# EAGLE design 16-Channel PWM Driver(PCA9685) (EAGLE 6.4)
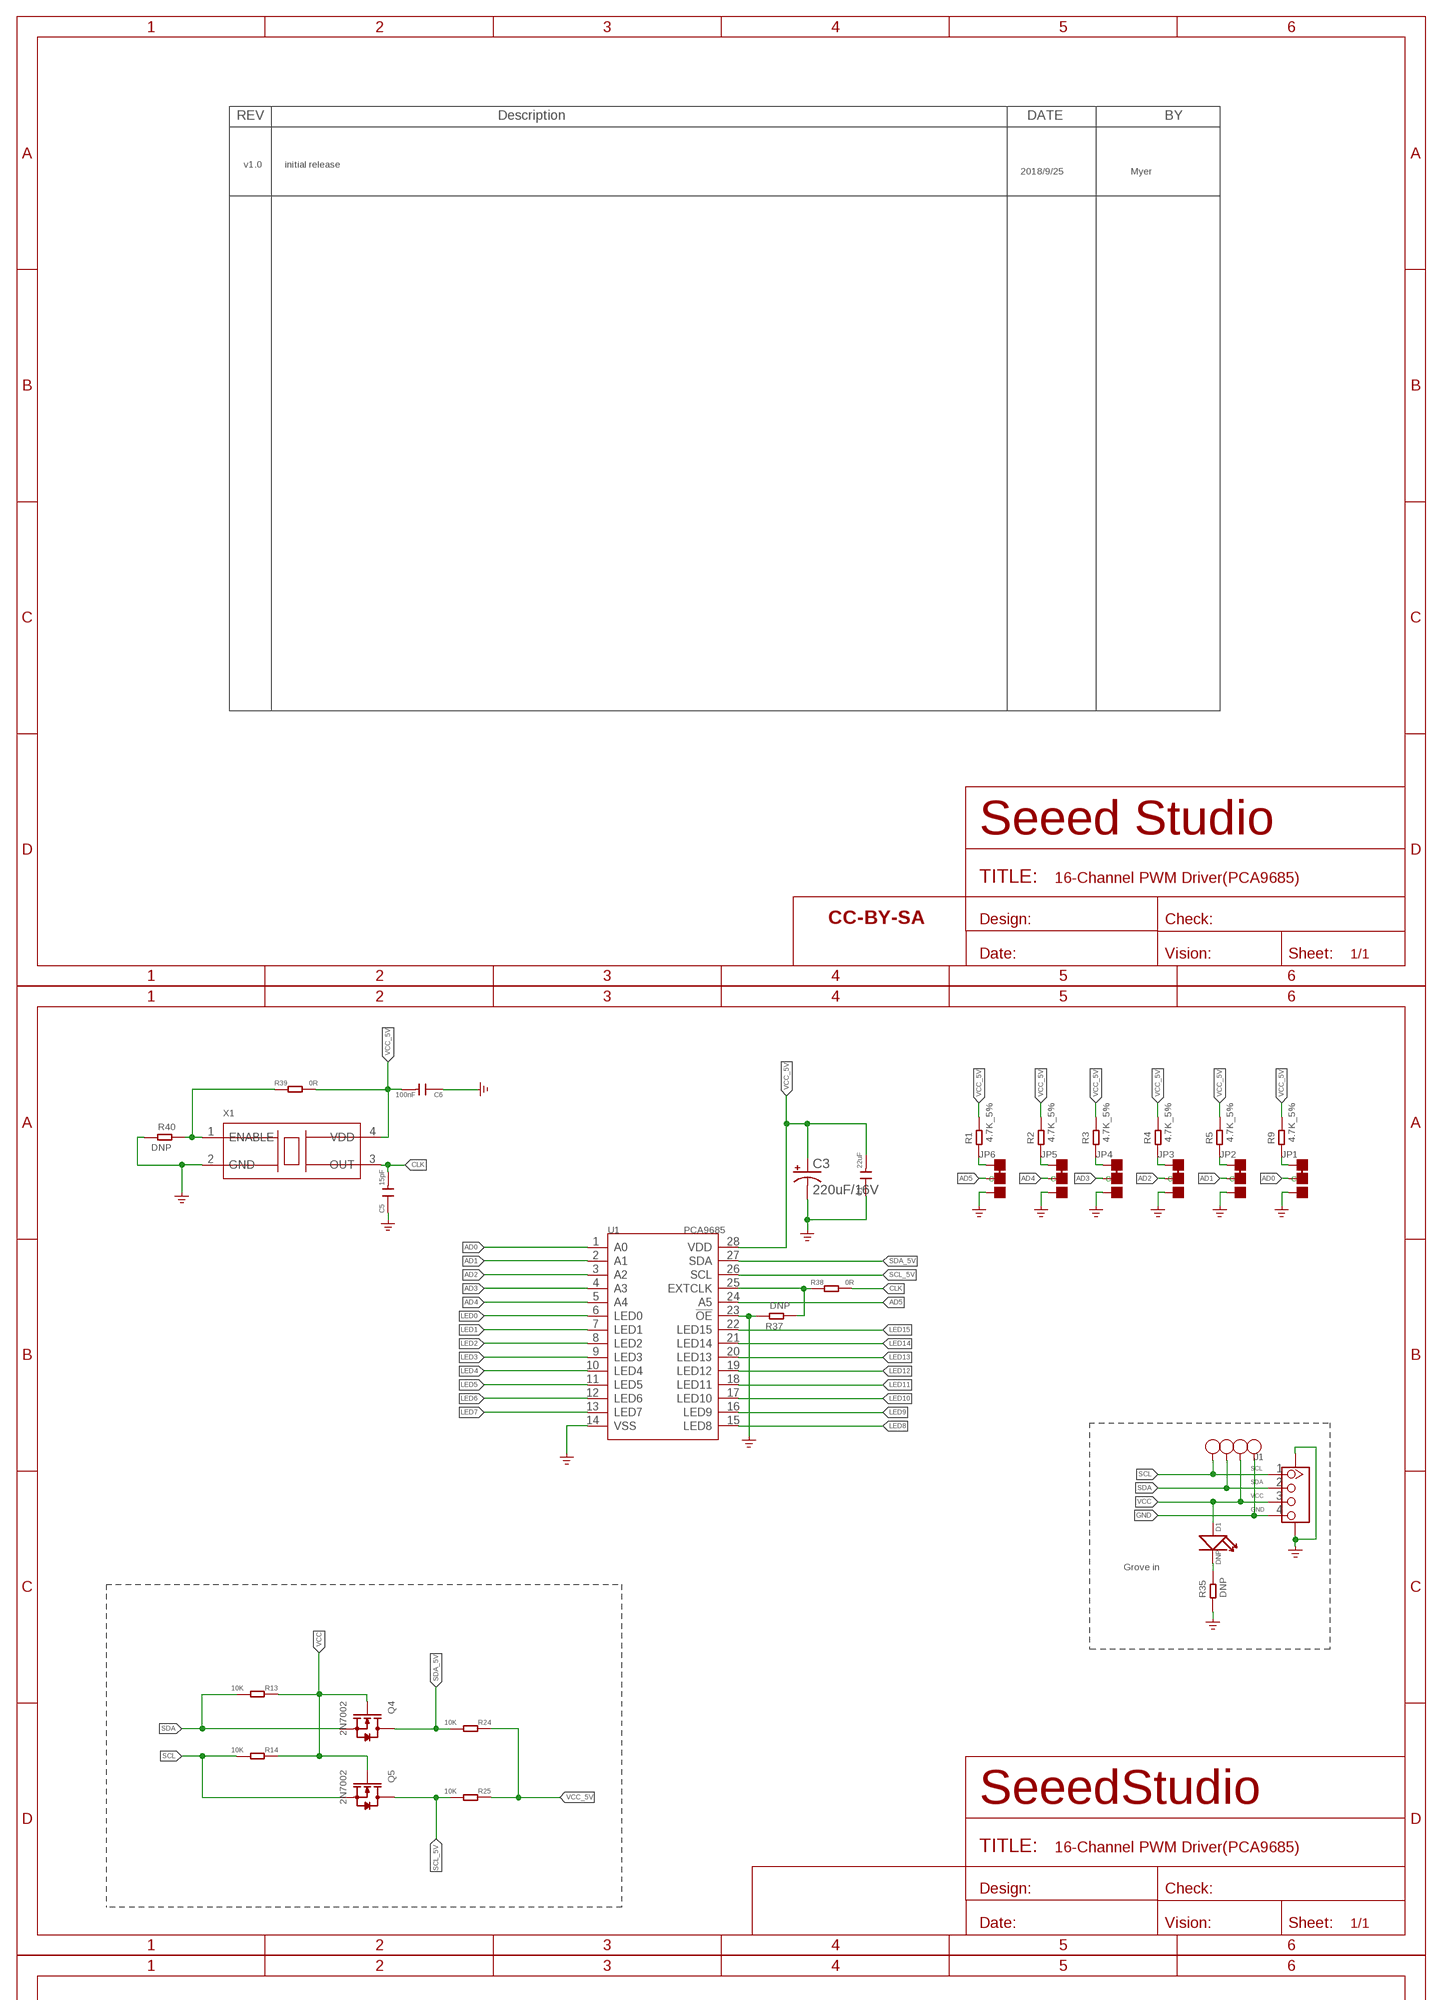
[diagram p0: schematic, sheet 1, part 1 of 2]
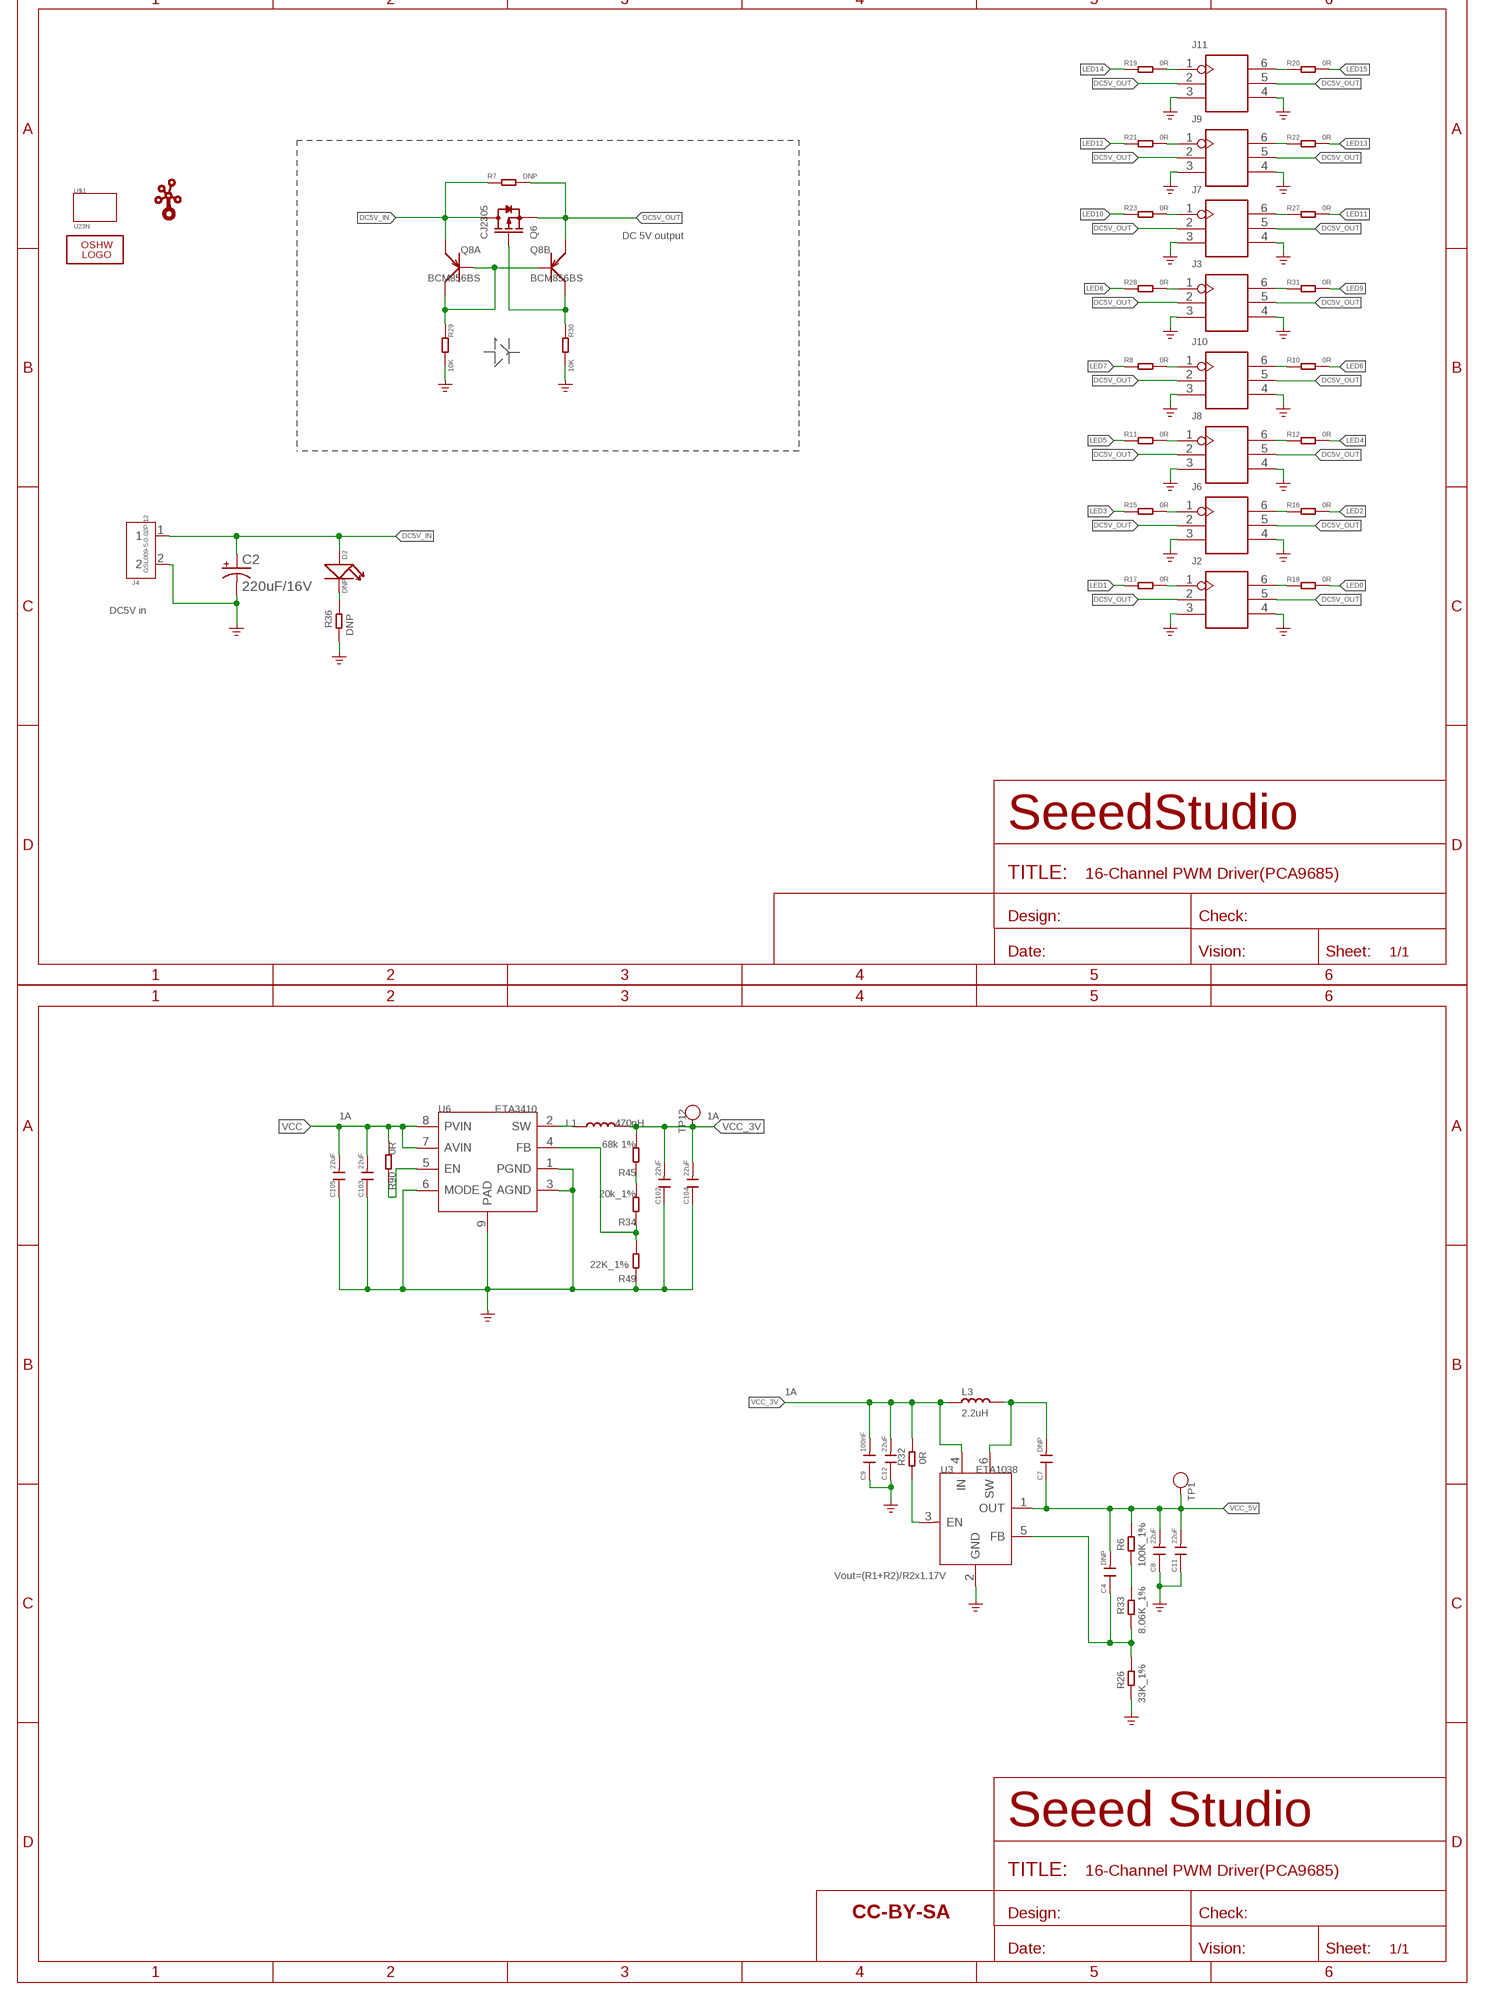
[diagram p1: schematic, sheet 1, part 2 of 2]

## Parts
C1  22uF  C-0805  [C0805]
C2  220uF/16V  CPOL-USD  [PANASONIC_D]
C3  220uF/16V  CPOL-USD  [PANASONIC_D]
C4  DNP  C-0603  [C0603]
C5  15pF  C-0603  [C0603]
C6  100nF  C-0603  [C0603]
C7  DNP  C-0603  [C0603]
C8  22uF  C-0603  [C0603]
C9  100nF  C-0603  [C0603]
C11  22uF  C-0603  [C0603]
C12  22uF  C-0603  [C0603]
C102  22uF  C-0603  [C0603]
C103  22uF  C-0603  [C0603]
C104  22uF  C-0603  [C0603]
C105  22uF  C-0603  [C0603]
D1  DNP  LED'0603'  [LED-0603]
D2  DNP  LED'0603'  [LED-0603]
FR1  SEEEDSTUDIO-OPEN-SCH-FRAME  [SEEEDSTUDIO-PCB-FRAME]
FR2  SEEEDSTUDIO-OPEN-SCH-FRAME  [SEEEDSTUDIO-PCB-FRAME]
GND1  TEST-POINT'4545'  [TP-D45MIL]
J1  GROVE-CONNECTOR-SMD'90D'  [HW4-SMD-2.0-90D]
J2  HEADER-2X3P-2.54  [H2X3-2.54]
J3  HEADER-2X3P-2.54  [H2X3-2.54]
J4  GSL009-5.0-02P-12  SCREW-TERMINAL-2P'5.0-10.6X10X14.8H'  [2P-5.0-10.6X10X14.8H]
J6  HEADER-2X3P-2.54  [H2X3-2.54]
J7  HEADER-2X3P-2.54  [H2X3-2.54]
J8  HEADER-2X3P-2.54  [H2X3-2.54]
J9  HEADER-2X3P-2.54  [H2X3-2.54]
J10  HEADER-2X3P-2.54  [H2X3-2.54]
J11  HEADER-2X3P-2.54  [H2X3-2.54]
JP1  JP-3P-SHORT  [3P-SMD-SHORT]
JP2  JP-3P-SHORT  [3P-SMD-SHORT]
JP3  JP-3P-SHORT  [3P-SMD-SHORT]
JP4  JP-3P-SHORT  [3P-SMD-SHORT]
JP5  JP-3P-SHORT  [3P-SMD-SHORT]
JP6  JP-3P-SHORT  [3P-SMD-SHORT]
L1  470nH  L-MPM201610SR33_T  [L201610]
L3  2.2uH  INDUCTOR/FERRITE-BEAD'0806'  [L0806]
LOGO2  LOGO-OSHW-FILLX0200-NT  [OSHW_FILLX200_NOTEXT]
Q4  2N7002  MOSFET-N+'SI1304BDL'  [SOT-323]
Q5  2N7002  MOSFET-N+'SI1304BDL'  [SOT-323]
Q6  CJ2305  MOSFET-P'SI2323CDS/SI2305DS<BR>'  [SOT-23]
Q8  BCM856BS  TRANSISTOR-DUAL-PNP  [SOT-363]
R1  4.7K_5%  R-0603  [R0603]
R2  4.7K_5%  R-0603  [R0603]
R3  4.7K_5%  R-0603  [R0603]
R4  4.7K_5%  R-0603  [R0603]
R5  4.7K_5%  R-0603  [R0603]
R6  100K_1%  R-0603  [R0603]
R7  DNP  R-0805  [R0805]
R8  0R  R-0603  [R0603]
R9  4.7K_5%  R-0603  [R0603]
R10  0R  R-0603  [R0603]
R11  0R  R-0603  [R0603]
R12  0R  R-0603  [R0603]
R13  10K  R-0603  [R0603]
R14  10K  R-0603  [R0603]
R15  0R  R-0603  [R0603]
R16  0R  R-0603  [R0603]
R17  0R  R-0603  [R0603]
R18  0R  R-0603  [R0603]
R19  0R  R-0603  [R0603]
R20  0R  R-0603  [R0603]
R21  0R  R-0603  [R0603]
R22  0R  R-0603  [R0603]
R23  0R  R-0603  [R0603]
R24  10K  R-0603  [R0603]
R25  10K  R-0603  [R0603]
R26  33K_1%  R-0603  [R0603]
R27  0R  R-0603  [R0603]
R28  0R  R-0603  [R0603]
R29  10K  R-0603  [R0603]
R30  10K  R-0603  [R0603]
R31  0R  R-0603  [R0603]
R32  0R  R-0603  [R0603]
R33  8.06K_1%  R-0603  [R0603]
R34  20k_1%  R-0603  [R0603]
R35  DNP  R-0603  [R0603]
R36  DNP  R-0603  [R0603]
R37  DNP  R-0603  [R0603]
R38  0R  R-0603  [R0603]
R39  0R  R-0603  [R0603]
R40  DNP  R-0603  [R0603]
R45  68k 1%  R-0603  [R0603]
R49  22K_1%  R-0603  [R0603]
R90  0R  R-0603  [R0603]
SCL1  TEST-POINT'4545'  [TP-D45MIL]
SDA1  TEST-POINT'4545'  [TP-D45MIL]
TP1  TEST-POINT'4545'  [TP-D45MIL]
TP12  TEST-POINT'4545'  [TP-D45MIL]
U1  PCA9685  LED-RGB-24P-PCA9685  [TSSOP28-0.65-9.7X4.4X1.2MM]
U3  ETA1038  CONVERTER-ETA1038  [SOT-23-6]
U6  ETA3410  CONVERTER-ETA3410  [DFN8G-0.5-2X2MM]
U$1  U23N  [U2*3N]
U$3  TWIGLOGOTWIGLOGO_SMALL  [TWIGLOGO_SMALL]
VCC2  TEST-POINT'4545'  [TP-D45MIL]
X1  CRYSTAL-OSCILLATOR'7050'  [OSC4-SMD-7.0X5.0X1.0MM]

## Nets
AD0: JP1.MM(C) U1.1(A0)
AD1: JP2.MM(C) U1.2(A1)
AD2: JP3.MM(C) U1.3(A2)
AD3: JP4.MM(C) U1.4(A3)
AD4: JP5.MM(C) U1.5(A4)
AD5: JP6.MM(C) U1.24(A5)
CLK: C5.2 R38.2 X1.3(OUT)
DC5V_IN: C2.+ D2.+ J4.1 Q6.3(D) Q8.1(A:E) R7.1
DC5V_OUT: J2.2 J2.5 J3.2 J3.5 J6.2 J6.5 J7.2 J7.5 J8.2 J8.5 J9.2 J9.5 J10.2 J10.5 J11.2 J11.5 Q6.2(S) Q8.4(B:E) R7.2
GND: C1.1 C2.- C3.- C5.1 C6.1 C8.1 C9.1 C11.1 C12.1 C102.1 C103.1 C104.1 C105.1 J1.4 J1.SS1 J1.SS2 J2.3 J2.4 J3.3 J3.4 J4.2 J6.3 J6.4 J7.3 J7.4 J8.3 J8.4 J9.3 J9.4 J10.3 J10.4 J11.3 J11.4 JP1.00(R) JP2.00(R) JP3.00(R) JP4.00(R) JP5.00(R) JP6.00(R) R26.1 R29.2 R30.2 R35.2 R36.2 R37.1 R40.2 R49.1 SCL1.T U1.14(VSS) U1.23(!OE) U3.2(GND) U6.1(PGND) U6.3(AGND) U6.6(MODE) U6.9(PAD) X1.2(GND) ; supply symbol labelled GND_POWER
LED0: R18.2 U1.6(LED0)
LED1: R17.1 U1.7(LED1)
LED2: R16.2 U1.8(LED2)
LED3: R15.1 U1.9(LED3)
LED4: R12.2 U1.10(LED4)
LED5: R11.1 U1.11(LED5)
LED6: R10.2 U1.12(LED6)
LED7: R8.1 U1.13(LED7)
LED8: R28.1 U1.15(LED8)
LED9: R31.2 U1.16(LED9)
LED10: R23.1 U1.17(LED10)
LED11: R27.2 U1.18(LED11)
LED12: R21.1 U1.19(LED12)
LED13: R22.2 U1.20(LED13)
LED14: R19.1 U1.21(LED14)
LED15: R20.2 U1.22(LED15)
N$1: JP1.11(L) R9.2
N$2: J3.1 R28.2
N$3: J11.1 R19.2
N$4: JP2.11(L) R5.2
N$5: JP3.11(L) R4.2
N$6: JP4.11(L) R3.2
N$7: JP5.11(L) R2.2
N$8: JP6.11(L) R1.2
N$9: J11.6 R20.1
N$10: J3.6 R31.1
N$11: J8.1 R11.2
N$12: J8.6 R12.1
N$13: J6.1 R15.2
N$14: J6.6 R16.1
N$15: J2.1 R17.2
N$16: Q8.2(A:B) Q8.5(B:B) Q8.6(A:C) R29.1
N$17: J2.6 R18.1
N$18: Q6.1(G) Q8.3(B:C) R30.1
N$19: J9.1 R21.2
N$20: J9.6 R22.1
N$21: J7.1 R23.2
N$22: J7.6 R27.1
N$23: J10.1 R8.2
N$24: J10.6 R10.1
N$25: R37.2 R38.1 U1.25(EXTCLK)
N$27: L1.1 U6.2(SW)
N$28: R90.1 U6.5(EN)
N$29: C7.2 L3.2 U3.6(SW)
N$30: C4.1 R26.2 R33.2 U3.5(FB)
N$31: R32.2 U3.3(EN)
N$32: R6.2 R33.1
N$33: R34.2 R45.1
N$34: D1.- R35.1
N$35: D2.- R36.1
N$36: R39.1 R40.1 X1.1(ENABLE)
N$49: R34.1 R49.2 U6.4(FB)
SCL: GND1.T J1.1 Q5.2(S) R14.2
SCL_5V: Q5.3(D) R25.2 U1.26(SCL)
SDA: J1.2 Q4.2(S) R13.2 VCC2.T
SDA_5V: Q4.3(D) R24.2 U1.27(SDA)
VCC: C103.2 C105.2 D1.+ J1.3 Q4.1(G) Q5.1(G) R13.1 R14.1 R90.2 SDA1.T U6.7(AVIN) U6.8(PVIN)
VCC_3V: C9.2 C12.2 C102.2 C104.2 L1.2 L3.1 R32.1 R45.2 TP12.T U3.4(IN)
VCC_5V: C1.2 C3.+ C4.2 C6.2 C7.1 C8.2 C11.2 R1.1 R2.1 R3.1 R4.1 R5.1 R6.1 R9.1 R24.1 R25.1 R39.2 TP1.T U1.28(VDD) U3.1(OUT) X1.4(VDD)

## Notes on the sheet
- v1.0 | initial release
- 2018/9/25 | Myer
- Grove in
- DC 5V output
- DC5V in
- 1A | 1A
- 1A
- Vout=(R1+R2)/R2x1.17V

## Library data of the parts
C1 C4-C9 C11 C12 C102-C105 = Discrete-small:C*: Ceramic Capacitors
C2 C3 = rcl:CPOL-US: POLARIZED CAPACITOR, American symbol
D1 D2 = Discrete-small:LED
FR1 FR2 = moudle-new:SEEEDSTUDIO-OPEN-SCH-FRAME
GND1 SCL1 SDA1 TP1 TP12 VCC2 = Discrete-new:TEST-POINT; PARTNO: DNP
J1 = Connector-new:GROVE-CONNECTOR-SMD: 4P-SMD-2.0:320110030;4P-SMD-2.0-90D:320110032
J2 J3 J6-J11 = Connector-new:HEADER-2X3P
J4 = Connector:SCREW-TERMINAL-2P
JP1-JP6 = Discrete-new:JP-3P-SHORT
L1 = Discrete-new:L
L3 = Discrete-new:INDUCTOR/FERRITE-BEAD
LOGO2 = Logo:LOGO-OSHW-FILL; PARTNO: DNP
Q4 Q5 = Discrete-new:MOSFET-N+: IRLL014: http://www.vishay.com/docs/91319/sihll014.pdf
Q6 = Discrete-new:MOSFET-P
Q8 = Discrete-new:TRANSISTOR-DUAL-PNP
R1-R40 R45 R49 R90 = Discrete-small:R*
U1 = Discrete-new:LED-RGB-24P-PCA9685
U3 = IC-new:CONVERTER-ETA1038
U6 = IC-new:CONVERTER-ETA3410: 3MHZ 2A High Step-Down Converter in DFN2x2-8L Package
U$1 = twig_template1:U2*3N
U$3 = seeedleo:TWIGLOGO
X1 = Discrete-new:CRYSTAL-OSCILLATOR

## Board
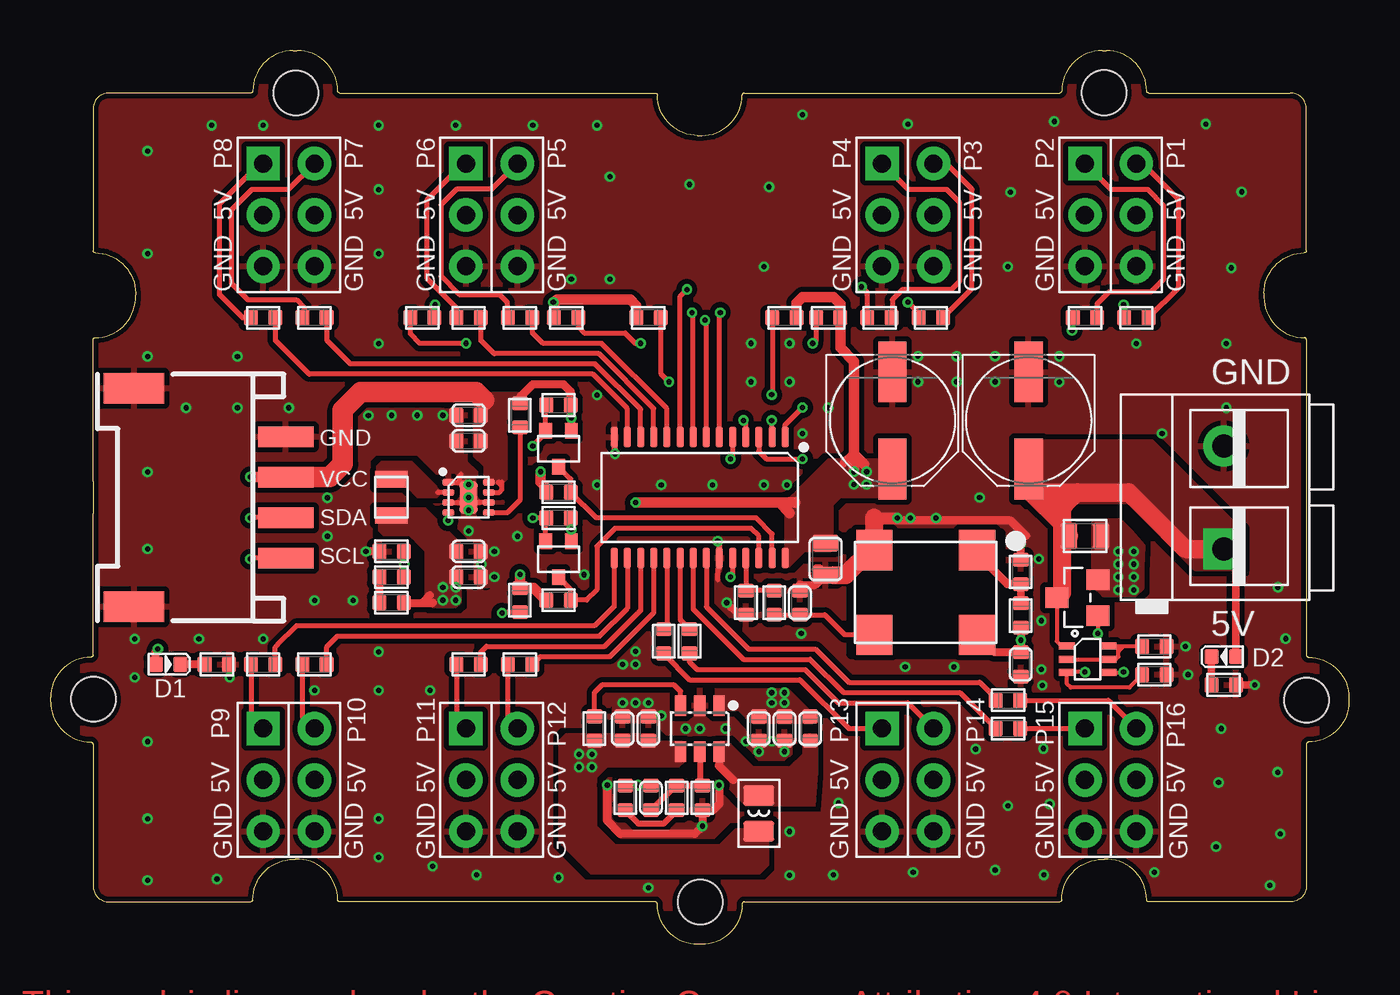
[diagram p2: board, top side]
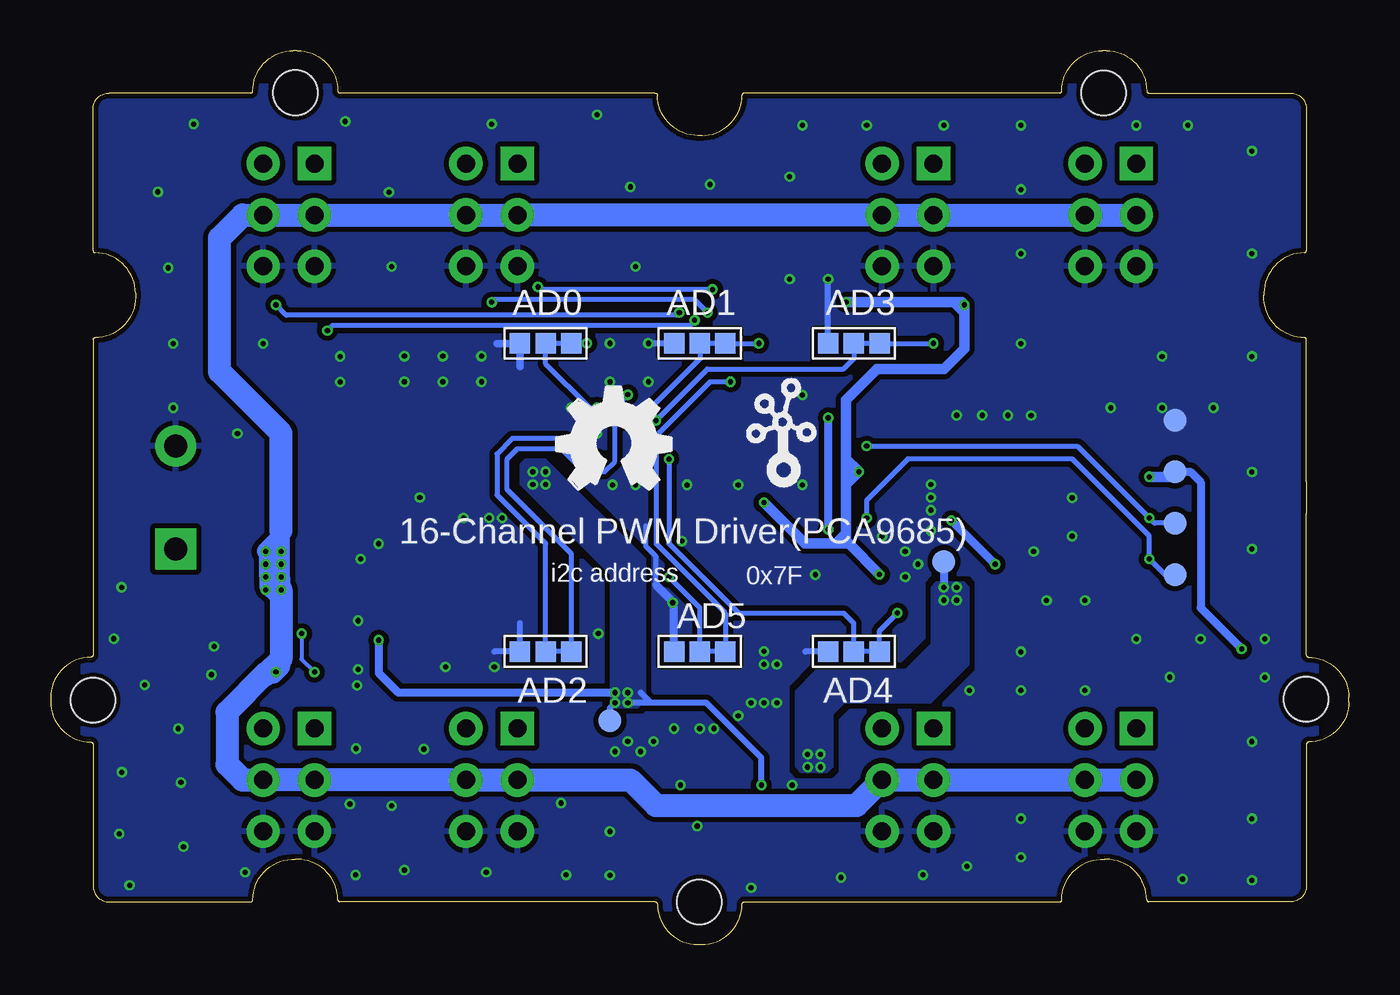
[diagram p3: board, bottom side, seen from below]

Size 64.2 x 44.2 mm. Coordinates in mm from the lower left corner, seen from the top.
Copper layers (1*16): Top 0.035mm / dielectric 1.5mm / Bottom 0.035mm
Design rules "SeeedStudio_2layer_DRU_no_angle_20140221 *": minimum track width 1mil, minimum drill 10mil, track to track 6mil, track to pad 6mil, pad to pad 6mil, via to via 6mil, smd to smd 0mil, copper to edge 10mil, drill to drill 10mil, minimum pad ring 4mil, minimum via ring 4mil, stop-mask expansion 2mil, vias tented up to drill 25mil, thermal gap 10mil
tRestrict: area 39.6,14.4 to 47,20.3

### Footprints (pad centres in the part's own frame; a part is rotated, then mirrored left to right if it is on the bottom)
C0805 = smd 0.819 x 1.27: 1 -0.79,0; 2 0.79,0
PANASONIC_D = smd 3 x 1.4: + 2.4,0; - -2.4,0
C0603 = smd 0.762 x 0.696: 1 0,0.602; 2 0,-0.602
LED-0603 = smd 0.696 x 0.762: + -0.602,0; - 0.602,0
TP-D45MIL = smd 1.143 x 1.143: T 0,0
HW4-SMD-2.0-90D = smd 1.01 x 2.74: 1 -3,-0.1; 2 -1,-0.1; 3 1,-0.1; 4 3,-0.1 | smd 1.5 x 3: SS1 -5.4,7.4; SS2 5.4,7.4
H2X3-2.54 = drill 0.889 pad 1.651 square: 1 -1.27,2.54 | drill 0.889 pad 1.651: 2 -1.27,0; 3 -1.27,-2.54; 4 1.27,-2.54; 5 1.27,0; 6 1.27,2.54
2P-5.0-10.6X10X14.8H = drill 1.143 pad 2.032 square: 1 -2.54,-0.508 | drill 1.143 pad 2.032: 2 2.54,-0.508
3P-SMD-SHORT = smd 1.016 x 1.016: 00 -1.27,0; 11 1.27,0; MM 0,0
L201610 = smd 0.8 x 1.6: 1 -0.9,0; 2 0.9,0
L0806 = smd 1.016 x 1.524: 1 -0.889,0; 2 0.889,0
SOT-323 = smd 0.635 x 0.762: 1 -0.635,-0.889; 2 0.635,-0.889; 3 0,0.889
SOT-23 = smd 1.143 x 1.016: 1 1.016,-0.889; 2 1.016,0.889; 3 -1.016,0
SOT-363 = smd 0.35 x 0.8: 1 -0.65,-1.025; 2 0,-1.025; 3 0.65,-1.025; 4 0.65,1.025; 5 0,1.025; 6 -0.65,1.025
R0603 = smd 0.762 x 0.696: 1 0,0.602; 2 0,-0.602
R0805 = smd 0.819 x 1.27: 1 -0.79,0; 2 0.79,0
TSSOP28-0.65-9.7X4.4X1.2MM = smd 0.35 x 1.025: 1 -4.225,-2.987; 2 -3.575,-2.987; 3 -2.925,-2.987; 4 -2.275,-2.987; 5 -1.625,-2.987; 6 -0.975,-2.987; 7 -0.325,-2.987; 8 0.325,-2.987; 9 0.975,-2.987; 10 1.625,-2.987; 11 2.275,-2.987; 12 2.925,-2.987; 13 3.575,-2.987; 14 4.225,-2.987; 15 4.225,2.987; 16 3.575,2.987; 17 2.925,2.987; 18 2.275,2.987; 19 1.625,2.987; 20 0.975,2.987; 21 0.325,2.987; 22 -0.325,2.987; 23 -0.975,2.987; 24 -1.625,2.987; 25 -2.275,2.987; 26 -2.925,2.987; 27 -3.575,2.987; 28 -4.225,2.987
SOT-23-6 = smd 0.55 x 1.016: 1 -0.95,-1.143; 2 0,-1.143; 3 0.95,-1.143; 4 0.95,1.143; 5 0,1.143; 6 -0.95,1.143
DFN8G-0.5-2X2MM = smd 0.6 x 0.3: 1 -1,0.75; 2 -1,0.25; 3 -1,-0.25; 4 -1,-0.75; 5 1,-0.75; 6 1,-0.25; 7 1,0.25; 8 1,0.75 | smd 0.9 x 1.6: 9 0,0
U2*3N = hole 2.2: -0.017,20.015; -30.005,10.02; 29.985,9.983; 19.98,-20.005; -19.983,-20.015
OSC4-SMD-7.0X5.0X1.0MM = smd 1.8 x 2: 1 -2.54,-2.1; 2 2.54,-2.1; 3 2.54,2.1; 4 -2.54,2.1

### Placement (x,y rotation side)
C1  38.32,19.05 90 top
C2  48.36,25.91 270 top
C3  41.62,25.91 270 top
C4  29.69,7.24 180 top
C5  37.05,16.89 0 top
C6  47.98,13.85 180 top
C7  37.56,10.67 0 top
C8  35.02,10.67 180 top
C9  29.56,10.67 0 top
C11  36.29,10.67 180 top
C12  28.29,10.67 0 top
C102  20.67,19.43 270 top
C103  20.67,26.16 90 top
C104  20.67,18.16 270 top
C105  20.67,24.89 90 top
D1  5.81,13.85 0 top
D2  58.01,14.23 180 top
FR1  -1.43,-7.36 0 top  (outside the outline)
FR2  -0.41,-20.83 0 top  (outside the outline)
GND1  8.61,18.29 0 bottom
J1  11.53,22.1 90 top
J2  52.42,36.07 0 top
J3  11.78,8.13 0 top
J4  57.5,22.1 90 top
J6  42.39,36.07 0 top
J7  21.81,8.13 0 top
J8  21.81,36.07 0 top
J9  42.39,8.13 0 top
J10  11.78,36.07 0 top
J11  52.42,8.13 0 top
JP1  39.72,29.72 0 bottom
JP2  32.1,29.72 0 bottom
JP3  39.72,14.48 0 bottom
JP4  24.48,29.72 0 bottom
JP5  24.48,14.48 0 bottom
JP6  32.1,14.48 0 bottom
L1  16.86,22.1 270 top
L3  35.02,6.48 90 top
LOGO2  39.19,22.49 0 bottom
Q4  25.12,24.51 180 top
Q5  25.12,19.05 180 top
Q6  50.77,17.15 0 top
Q8  51.28,14.1 270 top
R1  29.56,30.99 90 top
R2  23.21,17.02 0 top
R3  18.38,30.99 270 top
R4  36.29,30.99 270 top
R5  25.5,30.99 90 top
R6  28.42,7.24 0 top
R7  51.15,20.2 0 top
R8  10.51,30.99 270 top
R9  38.45,30.99 270 top
R10  13.05,30.99 90 top
R11  20.67,30.99 270 top
R12  23.21,30.99 90 top
R13  25.12,26.67 270 top
R14  25.12,21.08 270 top
R15  40.99,30.99 90 top
R16  43.53,30.99 270 top
R17  51.15,30.99 90 top
R18  53.69,30.99 270 top
R19  47.34,10.67 90 top
R20  47.34,12.07 270 top
R21  30.32,14.99 0 top
R22  31.59,14.99 180 top
R23  20.67,13.85 270 top
R24  25.12,22.35 90 top
R25  25.12,17.02 90 top
R26  32.23,7.24 180 top
R27  23.21,13.85 90 top
R28  10.51,13.85 270 top
R29  54.58,14.73 90 top
R30  54.58,13.34 90 top
R31  13.05,13.85 90 top
R32  26.89,10.67 180 top
R33  30.96,7.24 180 top
R34  16.86,18.16 270 top
R35  8.22,13.85 90 top
R36  58.01,12.83 90 top
R37  34.39,16.89 180 top
R38  35.78,16.89 0 top
R39  47.98,16.26 0 top
R40  47.98,18.42 180 top
R45  16.86,16.89 90 top
R49  16.86,19.43 90 top
R90  23.21,26.16 180 top
SCL1  8.61,25.91 0 bottom
SDA1  8.61,23.37 0 bottom
TP1  36.55,11.05 270 bottom
TP12  20.04,18.93 180 bottom
U1  32.1,22.1 180 top
U3  32.1,10.67 180 top
U6  20.67,22.1 0 top
U$1  32.1,22.1 180 top
U$3  30.2,22.48 0 bottom
VCC2  8.61,20.83 0 bottom
X1  43.28,17.4 180 top

### Tracks (layer width: path | path; a pad name or v marks a point on that pad's centre or on a via)
AD0  (via drill 0.25 pad 0.51)
  Top 0.254: U1.1 36.33,25.69 v37.18,26.55
  Bottom 0.254: JP1.MM 39.72,28.7 37.56,26.55 v37.18,26.55
AD1  (via drill 0.25 pad 0.51)
  Top 0.254: U1.2 35.68,25.89 v35.66,25.91
  Bottom 0.254: JP2.MM 32.1,28.96 35.15,25.91 v35.66,25.91
AD2  (via drill 0.25 pad 0.51)
  Top 0.254: U1.3 35.02,24.38 35.4,24.01 v37.18,24.01
  Bottom 0.254: v37.18,24.01 37.69,24.01 38.7,25.02 41.37,25.02 42.13,24.26 42.13,22.23 39.72,19.81 JP3.MM
AD3  (via drill 0.25 pad 0.51)
  Top 0.254: U1.4 34.38,25.79 v34.26,25.91
  Bottom 0.254: v34.26,25.91 31.72,28.45 24.99,28.45 24.48,28.96 JP4.MM
AD4  (via drill 0.25 pad 0.51)
  Top 0.254: U1.5 33.73,24.11 v33.62,24.01
  Bottom 0.254: JP5.MM 24.48,15.88 24.99,16.39 30.2,16.39 33.62,19.81 v33.62,24.01
AD5  (via drill 0.25 pad 0.51)
  Top 0.254: U1.24 33.73,18.26 v33.62,18.16
  Bottom 0.254: JP6.MM 32.1,16.64 v33.62,18.16
CLK
  Top 0.254: R38.2 C5.2 38.29,16.29 39.28,15.3 X1.3
DC5V_IN
  Top 0.203: Q6.3 49.75,14.99 50.01,14.73 50.24,14.73 Q8.1
  Top 0.381: D2.+ 58.61,18.96 J4.1
  Top 0.889: C2.+ 48.36,22.48 48.48,22.35 | 48.48,22.35 50.01,20.83 50.01,20.7 | 50.01,20.7 50.01,17.4 Q6.3 | R7.1 50.13,20.2 50.13,20.32 | 50.01,20.7 50.13,20.58 50.13,20.32 | 48.48,22.35 50.01,22.35 | 50.01,22.35 50.77,22.35 | 50.77,22.35 53.31,22.35 56.1,19.56 J4.1 | 50.01,22.35 50.01,20.45 50.13,20.32 | 50.77,22.35 50.13,21.72
  pour Top (no thermals): 48.1,24.89 54.45,24.89 58.9,20.45 58.9,18.54 56.61,18.54 53.31,21.85 48.48,21.85 47.98,22.35 47.98,24.77
DC5V_OUT  (via drill 0.25 pad 0.51)
  Top 0.203: Q8.4 v53.04,13.45 v53.05,13.46
  Bottom 0.635: 52.8,20.45 52.8,20.2 | 53.31,19.56 53.56,19.31 v53.56,18.16 53.56,17.66 53.05,17.15
  Bottom 0.889: v52.8,17.53 v52.8,18.16 52.8,19.05 | 52.8,14.1 52.8,13.72 v53.05,13.46 | v53.05,13.46 53.48,13.46 | J3.5 12.92,8.13 | 52.8,19.05 52.8,20.45 | 12.92,36.07 J10.5 13.18,35.94 | 52.8,19.05 53.44,18.42 53.44,17.91 | 53.56,13.34 53.18,13.34 v53.05,13.46 | 52.8,20.2 v53.56,19.43
  Bottom 1.143: 53.48,13.46 55.47,11.48 55.47,8.89 54.71,8.13 J11.5 J11.2 J9.5 J9.2 35.53,8.13 34.27,6.87 24.35,6.87 J7.5 J7.2 J3.5 J3.2 | 52.8,20.45 52.8,25.28 55.85,28.32 55.85,34.93 54.71,36.07 J2.5 J2.2 J6.5 J6.2 J8.5 J8.2 J10.5 J10.2 | v52.8,17.53 52.8,14.1 53.56,13.34
  other vias: 52.8,18.8 53.56,18.8 52.8,19.43 53.56,17.53
  pour Top (no thermals): 54,17.63 54,18.6 54,18.63 54.06,19.7 53.44,20.42 52.9,20.96 51.66,20.96 51.53,20.83 51.53,17.78 52.05,17.27 53.63,17.27
GND  (via drill 0.25 pad 0.51)
  Top 0.203: 33.08,19.73 32.86,19.94 v32.99,19.94
  Top 0.254: U6.1 20.23,22.85 | 20.23,22.85 20.53,22.85 20.54,22.86 | 20.23,22.85 20.23,23.18 20.29,23.24 | U6.3 20.42,21.85 U6.9 20.92,21.85 U6.6 | U1.23 33.08,18.63 32.99,18.54 32.99,18.04
  Top 0.305: 27.88,25.33 U1.14 27.88,24.29 v27.91,24.26 | U1.23 33.08,19.73
  Top 0.381: R37.1 34.04,16.29 v33.43,16.89 | C5.1 37.05,17.78 | 37.88,18.61 37.81,18.54 | R36.2 v59.53,12.83
  Top 0.406: R49.1 v15.59,19.43 | v27.53,7.88 27.53,6.1 28.16,5.46 31.85,5.46 v32.23,5.84 R26.1 32.77,6.64 33.05,6.92 v33.05,7.88 | 37.05,17.78 37.81,17.78 38.32,18.29 | 38.32,18.29 C1.1 38.73,18.26 39.5,18.26 X1.2 40.74,19.94 40.74,20.7 40.8,20.77 40.99,20.96 47.47,20.96 48.23,20.2 | 37.88,18.61 38,18.61 38.32,18.29 | R40.2 v47.98,19.81
  Top 0.508: v41.88,21.08 41.12,21.08 40.8,20.77
  Top 0.889: 38.73,18.26 39.31,18.26 40.61,19.56 | 40.74,19.94 40.74,21.08
  Bottom 0.254: 34.26,17.78 34.26,19.18 34.77,19.69 34.77,20.7
  Bottom 0.305: JP5.00 26.89,14.48 | 40.99,15.88 JP3.00 42.26,14.48 | JP2.00 v34.64,29.72 | JP4.00 v25.75,32.9
  Bottom 0.381: 40.99,28.58 JP1.00 42.13,29.72
  Bottom 0.406: 34.26,17.78 33.37,16.89 JP6.00
  other vias: 37.18,41.02 58.9,37.21 54.58,3.56 49.12,3.43 38.7,3.43 25.12,3.3 42.39,40.57 49.63,40.69 57.12,40.57 58.39,33.45 8.22,3.23 16.23,4.31 16.23,6.21 18.89,3.86 37.12,15.37 28.29,11.94 28.93,11.94 29.56,11.94 30.2,11.31 34.39,10.04 35.66,10.04 35.02,9.53 36.29,9.53 8.86,13.21 20.67,22.1 20.67,21.46 20.67,22.74 20.67,20.45 21.94,19.43 21.3,18.8 21.94,18.16 19.4,26.16 18.13,26.16 16.86,26.16 28.93,14.48 28.93,13.85 28.29,13.85 32.1,10.67 33.37,10.67 31.4,10.67 42.9,29.09 42.9,27.82 44.8,27.82 44.8,29.09 46.7,29.09 46.7,27.82 34.64,27.82 36.55,29.72 36.55,27.82 27.66,32.9 13.05,12.56 16.23,12.56 18.77,12.56 4.8,3.16 4.8,6.21 4.8,10.02 4.16,13.2 4.16,15.1 7.34,15.1 10.51,15.1 13.05,17.01 14.96,17.01 13.69,20.18 13.69,22.09 15.72,26.15 11.78,26.53 9.24,26.53 6.7,26.53 4.8,23.36 4.8,19.55 4.8,29.07 4.8,34.15 4.8,39.23 9.24,29.07 16.23,29.71 16.23,34.15 16.23,37.33 16.23,40.5 20.04,40.5 10.51,40.5 7.97,40.5 23.84,40.5 27.02,40.5 27.66,37.96 31.59,37.58 35.53,37.45 35.27,33.52 47.34,33.52 47.47,37.2 53.69,29.71 49.88,27.8 58.14,29.71 58.14,26.53 54.96,25.26 49.88,29.07 23.08,20.18 26.39,18.28 27.02,22.72 30.2,22.72 32.73,22.72 35.27,22.72 36.42,22.72 37.18,25.26 38.45,26.53 27.02,27.17 36.55,3.42 36.55,5.58 46.7,3.67 47.34,6.85 42.65,3.56 56.12,14.73 21.06,3.43 61.07,15.12 60.69,17.66 16.23,14.47 56.24,13.34 42.51,21.08 45.94,22.1 57.88,10.67 57.63,4.83 57.75,8 60.67,8.51 60.8,5.46 60.29,2.92 29.56,2.8 38.96,6.99 44.67,13.72 42.26,13.72 43.78,21.08 48.86,19.05 48.99,13.59 48.99,16 49.04,12.8 49.09,9.68 45.74,9.65 49.4,6.94
  pour Top (isolate 0.254, no thermals): 36.55,9.27 34.89,9.27 33.75,10.42 30.45,10.42 29.94,10.92 28.04,10.92 27.78,11.18 27.78,12.19 28.04,12.45 29.69,12.45 30.96,11.18 31.72,11.18 31.85,11.31 31.85,12.07 31.97,12.19 32.23,12.19 32.35,12.07 32.35,11.31 32.48,11.18 33.75,11.18 34.64,10.29 36.55,10.29 36.67,10.16 36.67,9.4
  pour Top (isolate 0.254, no thermals): 21.18,17.66 22.07,17.66 22.45,18.04 22.45,19.81 21.05,21.21 21.05,23.37 20.42,24.01 20.42,26.42 20.29,26.55 16.73,26.55 16.61,26.42 16.61,25.02 16.86,24.77 18.51,24.77 20.29,22.99 20.29,20.58 20.92,19.94 20.92,17.91
  pour Top (isolate 0.254, rank 6): 1.62,42.42 62.58,42.42 62.58,1.78 1.62,1.78
  pour Bottom (isolate 0.254, rank 6): 1.62,42.42 62.58,42.42 62.58,1.78 1.62,1.78
LED0  (via drill 0.25 pad 0.51)
  Top 0.254: U1.6 33.08,31.2 v33.12,31.24 | R18.2 53.09,31.59 v53.05,31.62
  Bottom 0.254: v33.12,31.24 33.24,31.12 52.55,31.12 v53.05,31.62
LED1  (via drill 0.25 pad 0.51)
  Top 0.254: U1.7 32.43,30.79 v32.35,30.86 | R17.1 50.55,30.39 v50.52,30.36
  Bottom 0.254: v32.35,30.86 32.61,30.61 50.26,30.61 v50.52,30.36
LED2  (via drill 0.25 pad 0.51)
  Top 0.254: U1.8 31.78,31.19 v31.72,31.24 | R16.2 42.93,31.21 v42.39,31.75
  Bottom 0.254: v31.72,31.24 32.35,31.88 42.26,31.88 v42.39,31.75
LED3  (via drill 0.25 pad 0.51)
  Top 0.254: U1.9 31.12,32.05 v31.46,32.39 | R15.1 40.39,32.23 v40.1,32.51
  Bottom 0.254: v31.46,32.39 39.97,32.39 v40.1,32.51
LED4
  Top 0.254: U1.10 30.48,26.49 27.25,29.72 24.35,29.72 23.81,30.26 R12.2
LED5
  Top 0.254: U1.11 29.83,26.5 27.12,29.21 21.94,29.21 21.27,29.88 R11.1
LED6
  Top 0.254: U1.12 29.18,26.46 26.93,28.7 14.83,28.7 13.75,29.78 13.69,29.85 13.65,29.88 R10.2
LED7
  Top 0.254: U1.13 28.53,26.48 26.81,28.2 12.8,28.2 11.11,29.88 R8.1
LED8
  Top 0.254: U1.15 27.88,16.73 26.89,15.75 12.16,15.75 11.21,14.8 11.15,14.73 11.11,14.7 R28.1
LED9
  Top 0.254: R31.2 13.65,14.7 14.19,15.24 27.15,15.24 28.53,16.62 U1.16
LED10
  Top 0.254: U1.17 29.18,16.51 29.05,16.39 28.93,16.26 27.4,14.73 21.56,14.73 21.27,14.45 R23.1
LED11
  Top 0.254: U1.18 29.83,16.4 27.66,14.23 24.23,14.23 23.84,13.85 R27.2
LED12
  Top 0.254: U1.19 30.48,15.74 R21.1
LED13
  Top 0.254: U1.20 31.12,16.06 R22.2
LED14
  Top 0.254: U1.21 31.78,16.58 34.26,14.1 37.56,14.1 39.21,12.45 44.96,12.45 R19.1
LED15
  Top 0.254: U1.22 32.43,16.7 34.51,14.61 37.81,14.61 39.47,12.96 45.94,12.96 46.83,12.07 R20.2 46.7,12.07
N$1  (via drill 0.25 pad 0.51)
  Top 0.254: R9.2 37.85,29.88 v37.69,29.72
  Bottom 0.254: JP1.11 v37.69,29.72
N$2
  Top 0.254: R28.2 9.91,11.27 J3.1
N$3
  Top 0.254: R19.2 J11.1
N$4  (via drill 0.25 pad 0.51)
  Top 0.254: R5.2 26.1,30.52 26.39,30.23 28.42,30.23 28.93,29.72 v29.18,29.72
  Bottom 0.254: JP2.11 v29.18,29.72
N$5  (via drill 0.25 pad 0.51)
  Top 0.254: R4.2 35.69,27.21 v35.66,27.18
  Bottom 0.254: v35.66,27.18 36.29,26.55 36.29,23.88 36.8,23.37 37.81,23.37 38.96,24.51 41.12,24.51 41.62,24.01 41.62,22.48 38.45,19.31 JP3.11
  Bottom 0.305: 39.69,14.51 39.72,14.48
N$6  (via drill 0.25 pad 0.51)
  Top 0.254: v20.54,29.72 18.26,29.72 17.78,30.2 R3.2
  Bottom 0.254: JP4.11 v20.54,29.72
N$7  (via drill 0.25 pad 0.51)
  Top 0.254: R2.2 22.35,16.42 v22.32,16.39
  Bottom 0.254: JP5.11 23.21,15.5 v22.32,16.39
N$8  (via drill 0.25 pad 0.51)
  Top 0.254: R1.2 30.16,28.23 v30.58,27.82
  Bottom 0.254: v30.58,27.82 31.59,27.82 34.26,25.15 34.26,19.81 30.83,16.39 JP6.11
N$9
  Top 0.254: R20.1 52.29,12.07 J11.6
N$10
  Top 0.254: R31.1 12.45,11.27 J3.6
N$11
  Top 0.254: R11.2 20.07,31.47 18.62,32.91 18.62,36.84 20.39,38.61 J8.1
N$12
  Top 0.254: J8.6 21.81,37.34 20.08,37.34 19.31,36.57 19.31,33.04 20.21,32.13 22.19,32.13 22.58,31.75 22.58,31.02 R12.1
N$13
  Top 0.254: J6.1 42.39,37.34 44.3,37.34 44.93,36.71 44.93,32.77 44.55,32.39 42.13,32.39 41.62,31.88 41.62,31.02 R15.2
N$14
  Top 0.254: J6.6 44.29,38.61 45.56,37.34 45.56,32.42 R16.1
N$15
  Top 0.254: R17.2 51.75,31.68 52.33,32.26 54.42,32.26 55.03,32.88 55.03,36.54 54.23,37.34 52.42,37.34 J2.1
N$16
  Top 0.203: Q8.2 Q8.5 52.67,14.1 52.8,14.23 52.8,14.48 | 52.8,14.48 52.8,14.61 52.67,14.73 | 52.67,14.73 52.32,14.73 Q8.6 | R29.1 53.05,14.73 | 53.05,14.73 52.67,14.73 | 53.05,14.73 52.8,14.48
N$17
  Top 0.254: J2.6 54,38.61 55.76,36.86 55.76,32.45 R18.1
N$18  (via drill 0.25 pad 0.51)
  Top 0.203: Q6.1 v51.78,15.37 | v51.15,13.46 50.27,13.46 Q8.3 50.26,13.44 50.26,12.88 50.44,12.7 53.34,12.7 R30.1
  Bottom 0.203: v51.78,15.37 51.78,14.1 v51.15,13.46
N$19
  Top 0.254: R21.2 30.32,14.35 31.59,13.08 37.05,13.08 39.47,10.67 J9.1
N$20
  Top 0.254: R22.1 31.59,13.97 31.97,13.59 37.31,13.59 38.96,11.94 42.39,11.94 J9.6
N$21
  Top 0.254: R23.2 20.07,11.15 J7.1
N$22
  Top 0.254: R27.1 22.61,11.15 J7.6
N$23
  Top 0.254: R8.2 9.49,30.99 8.35,32.13 8.35,36.64 10.33,38.61 10.38,38.61 10.51,38.74 J10.1
N$24
  Top 0.254: R10.1 12.54,31.08 12.54,31.5 12.16,31.88 9.75,31.88 8.95,32.68 8.95,36.33 9.96,37.34 11.78,37.34 J10.6
N$25
  Top 0.254: R38.1 R37.2 34.38,17.51 U1.25
N$27
  Top 0.254: U6.2 19.15,22.35
  pour Top (isolate 0.254, no thermals): 19.4,22.48 19.27,22.48 18.77,22.99 17.88,23.88 16.61,23.88 16.35,23.88 16.1,23.62 16.1,22.86 16.35,22.61 17.62,22.61 18.13,22.1 19.15,22.1 19.27,22.23 19.59,22.23 19.65,22.29 19.65,22.42 19.59,22.48
N$28
  Top 0.254: R90.1 23.21,21.97 22.59,21.35 U6.5
N$29
  Top 0.406: U3.6 33.05,8.83 33.75,8.13
  pour Top (isolate 0.254, no thermals): 32.86,9.78 32.86,9.27 33.37,8.77 33.37,7.85 34.36,6.86 37.83,6.86 37.94,8.5 37.94,10.31 37.58,10.42 37.46,10.42 37.18,10.13 37.18,9.4 36.55,8.77 34.77,8.77 33.5,10.04 33.12,10.04
N$30
  Top 0.305: C4.1 29.72,6.64 30.92,7.84 R33.2 R26.2 32.1,7.97 U3.5
N$31
  Top 0.254: U3.3 31.15,12.51 30.83,12.83 27.27,12.83 26.89,12.45 R32.2
N$32
  Top 0.305: R6.2 28.42,6.61 29.05,5.97 30.32,5.97 30.96,6.61 R33.1
N$33
  Top 0.406: R34.2 R45.1
N$34
  Top 0.406: R35.1 D1.-
N$35
  Top 0.381: R36.1 D2.-
N$36
  Top 0.381: R39.1 R40.1
  Top 0.406: R40.1 47.31,17.82 45.69,19.43 45.75,19.43 X1.1
N$49  (via drill 0.25 pad 0.51)
  Top 0.254: U6.4 19.67,20.97 v19.65,20.96
  Top 0.406: R49.2 17.46,18.83 v17.5,18.8 17.46,18.77 R34.1
  Bottom 0.406: v17.5,18.8 v19.65,20.96
SCL  (via drill 0.25 pad 0.51)
  Top 0.254: Q5.2 24.48,21.05 R14.2 v23.84,21.08 | J1.1 9.92,19.1 v9.88,19.05
  Bottom 0.254: GND1.T 9.11,18.29 v9.88,19.05 9.88,20.2 13.69,24.01 21.81,24.01 23.84,21.97 v23.84,21.08
SCL_5V
  Top 0.254: U1.26 35.02,20.19 34.64,20.58 27.91,20.58 27.02,19.69 27.02,17.53 26.51,17.02 R25.2 25.72,17.56 Q5.3
SDA  (via drill 0.25 pad 0.51)
  Top 0.254: R13.2 24.48,26.64 Q4.2 24.48,25.28 v23.84,24.64 | J1.2 9.89,21.1 v9.88,21.08
  Bottom 0.254: v23.84,24.64 13.43,24.64 v9.88,21.08 9.62,20.83 VCC2.T
SDA_5V
  Top 0.254: U1.27 35.68,20.3 34.89,21.08 26.99,21.08 R24.2 25.72,23.02 Q4.3
VCC  (via drill 0.25 pad 0.51)
  Top 0.254: U6.7 22.19,22.35 22.32,22.48 22.32,22.67 | 22.32,22.67 22.32,22.86 | 22.32,22.67 22.13,22.86
  Top 0.406: R90.2 23.21,27.05 23.84,27.69 25.37,27.69 25.72,27.34 R13.1 25.72,26.07 v25.75,26.04 Q4.1 | Q5.1 v25.75,20.51 25.75,21.05 R14.1 | D1.+ 5.21,14.51 v5.3,14.61
  Top 0.508: J1.3 9.89,23.1 v9.88,23.12
  Top 1.016: J1.3 13.8,23.1 14.45,23.75 14.45,26.42 15.34,27.31 21.05,27.31 21.43,26.93
  Bottom 0.406: v25.75,26.04 v25.75,20.51 | SDA1.T 7.84,23.37 7.34,22.86 7.34,16.64 v5.3,14.61
  Bottom 0.508: v9.88,23.12 8.86,23.12 SDA1.T
  pour Top (isolate 0.254, no thermals): 22.32,22.74 21.69,22.74 21.43,22.99 21.43,23.62 20.92,24.13 20.92,26.55 21.69,27.31 23.21,27.31 23.46,27.05 23.46,26.67 23.34,26.55 22.86,26.55 22.58,26.26 22.58,22.99
VCC_3V  (via drill 0.25 pad 0.51)
  Top 0.406: R45.2 18.38,16.89 | 18.38,16.89 18.89,16.89 | 18.38,16.89 18.77,17.27
  Bottom 0.406: TP12.T v20.04,17.66
  other vias: 20.04,17.02 19.4,17.02 19.4,17.66 26.77,9.4 26.13,9.4 26.77,8.77 26.13,8.77
  pour Top (isolate 0.254, no thermals): 16.48,21.59 18.51,21.59 20.29,19.81 20.29,16.89 20.04,16.64 18.89,16.64 18.51,17.02 18.51,19.43 17.75,20.2 16.48,20.2 16.23,20.45 16.23,21.34
  pour Bottom (isolate 0.254, no thermals): 19.02,17.91 20.42,17.91 20.67,17.66 20.67,14.86 21.94,13.59 26.32,13.59 27.4,12.51 27.4,8.79 27.12,8.51 25.78,8.51 25.5,8.79 25.5,11.4 24.96,11.94 20.67,11.94 18.77,13.85 18.77,17.66
  pour Top (isolate 0.254, no thermals): 31.21,10.04 30.2,10.04 29.81,10.42 25.47,10.42 25.12,10.06 25.12,5.06 26.69,3.48 35.07,3.48 35.53,3.94 35.53,5.46 35.27,5.72 33.88,5.72 33.08,4.92 27.94,4.92 27.02,5.84 27.02,8.26 27.53,8.77 31.08,8.77 31.34,9.02 31.34,9.91
VCC_5V  (via drill 0.25 pad 0.51)
  Top 0.305: C4.2 29.09,7.84 v29.05,7.88 29.02,7.84 R6.1
  Top 0.406: 46.17,15.66 X1.4 46.67,14.45 C6.2 v47.98,15.04 R39.2 | 39.72,24.26 39.67,24.26 39.19,23.78
  Top 0.508: R24.1 24.51,22.58 24.23,22.86 v24.23,23.37 | v23.21,18.29 R2.1 23.88,17.62 24.48,17.02 R25.1 | v28.93,21.85 36.04,21.85 | 36.04,21.85 36.8,21.85 | 36.04,21.85 36.55,21.34 | R5.1 24.89,31.72 | 24.89,31.72 v24.86,31.75 | R3.1 18.99,31.59 v19.02,31.62 | 39.72,24.26 39.72,28.83 39.05,29.5 R9.1 39.05,31.66 38.7,32.01 37.18,32.01 36.89,31.72 R4.1 | 39.72,24.26 v39.72,23.37 | 39.72,24.26 40.23,23.75 | R1.1 28.96,31.59 28.67,31.88 25.05,31.88 24.89,31.72
  Bottom 0.305: TP1.T 36.55,11.69 v36.29,11.94 | 34.51,11.94 31.78,11.94 29.05,9.22 v29.05,7.88 | 34.51,11.94 v35.66,11.94 | 34.51,11.94 35.02,12.45
  Bottom 0.406: v47.98,15.04 47.98,13.42 47,12.45 v36.29,12.45
  Bottom 0.508: 24.86,20.32 24.86,19.94 24.73,19.81 | 24.73,19.81 v23.21,18.29 | 24.73,19.81 25.37,19.81 | 25.37,19.81 26.89,19.81 v28.93,21.85 | 24.86,20.32 25.37,19.81 | 24.86,20.32 24.86,22.74 | 24.86,22.74 24.86,23.37 | 24.86,23.37 24.86,24.01 | 24.86,24.01 24.86,26.93 23.34,28.45 20.04,28.45 19.02,29.47 19.02,31.24 | 24.86,23.37 v24.23,23.37 | 24.86,24.01 v24.23,23.37 | 24.86,22.74 v24.23,23.37 | v24.86,31.75 19.53,31.75 | 19.53,31.75 19.15,31.75 v19.02,31.62 19.02,31.24 | 19.53,31.75 19.02,31.24
  other vias: 35.66,12.45 40.36,23.37 40.36,22.74 39.72,22.74
  pour Top (no thermals): 36.8,19.56 36.42,19.56 36.29,19.43 36.29,18.8 36.42,18.67 36.52,18.67 36.93,19.07 36.93,19.43
  pour Top (isolate 0.254, no thermals): 32.86,12.7 32.86,11.56 34.01,11.56 34.64,10.92 37.69,10.92 37.94,11.18 36.42,12.7
  pour Bottom (isolate 0.254, no thermals): 36.29,11.69 35.15,11.69 34.77,12.07 34.77,19.05 39.72,24.01 40.74,24.01 40.99,23.75 40.99,22.74 36.55,18.29 36.55,11.94
  pour Top (isolate 0.254, no thermals): 36.55,18.67 37.31,19.43 38.58,19.43 38.7,19.56 38.7,21.72 39.09,22.1 41.24,22.1 42.01,22.86 42.01,23.75 41.75,24.01 38.45,24.01 36.55,22.1 36.47,22.1 36.29,21.92 36.29,18.93

### Text on the board
tPlace: P8 | P7 | P6 | P5 | P4 | P2 | P1 | P3 | 5V | 5V | 5V | 5V | 5V | 5V | 5V | 5V | GND | GND | GND | GND | GND | GND | GND | GND | GND | GND | VCC | SDA | SCL | 5V | D2 | D1 | P10 | P11 | P13 | P14 | P15 | P16 | P9 | P12 | 5V | 5V | 5V | 5V | 5V | 5V | 5V | 5V | GND | GND | GND | GND | GND | GND | GND | GND
bPlace: AD3 | AD1 | AD0 | 16-Channel PWM Driver(PCA9685) | 0x7F | i2c address | AD5 | AD4 | AD2